# EAGLE schematic Main ACM Hub (EAGLE 9.2.1)
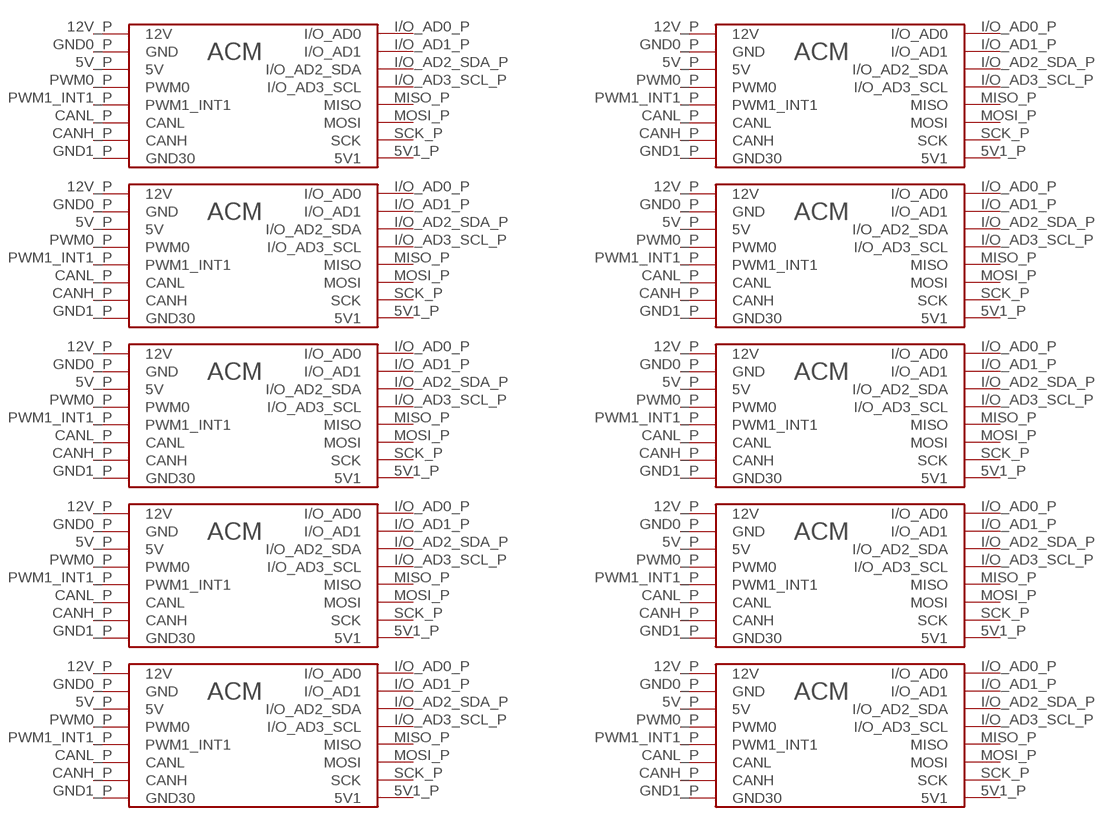
[diagram p0: schematic, sheet 1]

## Parts
U$1  ACM_CASTELLATED  [ACM_CAS_FP]
U$2  ACM_CASTELLATED  [ACM_CAS_FP]
U$3  ACM_CASTELLATED  [ACM_CAS_FP]
U$4  ACM_CASTELLATED  [ACM_CAS_FP]
U$5  ACM_CASTELLATED  [ACM_CAS_FP]
U$6  ACM_CASTELLATED  [ACM_CAS_FP]
U$7  ACM_CASTELLATED  [ACM_CAS_FP]
U$8  ACM_CASTELLATED  [ACM_CAS_FP]
U$9  ACM_CASTELLATED  [ACM_CAS_FP]
U$10  ACM_CASTELLATED  [ACM_CAS_FP]
Unconnected: U$1.5V1_P(5V1) U$1.5V_P(5V) U$1.12V_P(12V) U$1.CANH_P(CANH) U$1.CANL_P(CANL) U$1.GND0_P(GND) U$1.GND1_P(GND30) U$1.I/O_AD0_P(I/O_AD0) U$1.I/O_AD1_P(I/O_AD1) U$1.I/O_AD2_SDA_P(I/O_AD2_SDA) U$1.I/O_AD3_SCL_P(I/O_AD3_SCL) U$1.MISO_P(MISO) U$1.MOSI_P(MOSI) U$1.PWM0_P(PWM0) U$1.PWM1_INT1_P(PWM1_INT1) U$1.SCK_P(SCK) U$2.5V1_P(5V1) U$2.5V_P(5V) U$2.12V_P(12V) U$2.CANH_P(CANH) U$2.CANL_P(CANL) U$2.GND0_P(GND) U$2.GND1_P(GND30) U$2.I/O_AD0_P(I/O_AD0) U$2.I/O_AD1_P(I/O_AD1) U$2.I/O_AD2_SDA_P(I/O_AD2_SDA) U$2.I/O_AD3_SCL_P(I/O_AD3_SCL) U$2.MISO_P(MISO) U$2.MOSI_P(MOSI) U$2.PWM0_P(PWM0) U$2.PWM1_INT1_P(PWM1_INT1) U$2.SCK_P(SCK) U$3.5V1_P(5V1) U$3.5V_P(5V) U$3.12V_P(12V) U$3.CANH_P(CANH) U$3.CANL_P(CANL) U$3.GND0_P(GND) U$3.GND1_P(GND30) U$3.I/O_AD0_P(I/O_AD0) U$3.I/O_AD1_P(I/O_AD1) U$3.I/O_AD2_SDA_P(I/O_AD2_SDA) U$3.I/O_AD3_SCL_P(I/O_AD3_SCL) U$3.MISO_P(MISO) U$3.MOSI_P(MOSI) U$3.PWM0_P(PWM0) U$3.PWM1_INT1_P(PWM1_INT1) U$3.SCK_P(SCK) U$4.5V1_P(5V1) U$4.5V_P(5V) U$4.12V_P(12V) U$4.CANH_P(CANH) U$4.CANL_P(CANL) U$4.GND0_P(GND) U$4.GND1_P(GND30) U$4.I/O_AD0_P(I/O_AD0) U$4.I/O_AD1_P(I/O_AD1) U$4.I/O_AD2_SDA_P(I/O_AD2_SDA) U$4.I/O_AD3_SCL_P(I/O_AD3_SCL) U$4.MISO_P(MISO) U$4.MOSI_P(MOSI) U$4.PWM0_P(PWM0) U$4.PWM1_INT1_P(PWM1_INT1) U$4.SCK_P(SCK) U$5.5V1_P(5V1) U$5.5V_P(5V) U$5.12V_P(12V) U$5.CANH_P(CANH) U$5.CANL_P(CANL) U$5.GND0_P(GND) U$5.GND1_P(GND30) U$5.I/O_AD0_P(I/O_AD0) U$5.I/O_AD1_P(I/O_AD1) U$5.I/O_AD2_SDA_P(I/O_AD2_SDA) U$5.I/O_AD3_SCL_P(I/O_AD3_SCL) U$5.MISO_P(MISO) U$5.MOSI_P(MOSI) U$5.PWM0_P(PWM0) U$5.PWM1_INT1_P(PWM1_INT1) U$5.SCK_P(SCK) U$6.5V1_P(5V1) U$6.5V_P(5V) U$6.12V_P(12V) U$6.CANH_P(CANH) U$6.CANL_P(CANL) U$6.GND0_P(GND) U$6.GND1_P(GND30) U$6.I/O_AD0_P(I/O_AD0) U$6.I/O_AD1_P(I/O_AD1) U$6.I/O_AD2_SDA_P(I/O_AD2_SDA) U$6.I/O_AD3_SCL_P(I/O_AD3_SCL) U$6.MISO_P(MISO) U$6.MOSI_P(MOSI) U$6.PWM0_P(PWM0) U$6.PWM1_INT1_P(PWM1_INT1) U$6.SCK_P(SCK) U$7.5V1_P(5V1) U$7.5V_P(5V) U$7.12V_P(12V) U$7.CANH_P(CANH) U$7.CANL_P(CANL) U$7.GND0_P(GND) U$7.GND1_P(GND30) U$7.I/O_AD0_P(I/O_AD0) U$7.I/O_AD1_P(I/O_AD1) U$7.I/O_AD2_SDA_P(I/O_AD2_SDA) U$7.I/O_AD3_SCL_P(I/O_AD3_SCL) U$7.MISO_P(MISO) U$7.MOSI_P(MOSI) U$7.PWM0_P(PWM0) U$7.PWM1_INT1_P(PWM1_INT1) U$7.SCK_P(SCK) U$8.5V1_P(5V1) U$8.5V_P(5V) U$8.12V_P(12V) U$8.CANH_P(CANH) U$8.CANL_P(CANL) U$8.GND0_P(GND) U$8.GND1_P(GND30) U$8.I/O_AD0_P(I/O_AD0) U$8.I/O_AD1_P(I/O_AD1) U$8.I/O_AD2_SDA_P(I/O_AD2_SDA) U$8.I/O_AD3_SCL_P(I/O_AD3_SCL) U$8.MISO_P(MISO) U$8.MOSI_P(MOSI) U$8.PWM0_P(PWM0) U$8.PWM1_INT1_P(PWM1_INT1) U$8.SCK_P(SCK) U$9.5V1_P(5V1) U$9.5V_P(5V) U$9.12V_P(12V) U$9.CANH_P(CANH) U$9.CANL_P(CANL) U$9.GND0_P(GND) U$9.GND1_P(GND30) U$9.I/O_AD0_P(I/O_AD0) U$9.I/O_AD1_P(I/O_AD1) U$9.I/O_AD2_SDA_P(I/O_AD2_SDA) U$9.I/O_AD3_SCL_P(I/O_AD3_SCL) U$9.MISO_P(MISO) U$9.MOSI_P(MOSI) U$9.PWM0_P(PWM0) U$9.PWM1_INT1_P(PWM1_INT1) U$9.SCK_P(SCK) U$10.5V1_P(5V1) U$10.5V_P(5V) U$10.12V_P(12V) U$10.CANH_P(CANH) U$10.CANL_P(CANL) U$10.GND0_P(GND) U$10.GND1_P(GND30) U$10.I/O_AD0_P(I/O_AD0) U$10.I/O_AD1_P(I/O_AD1) U$10.I/O_AD2_SDA_P(I/O_AD2_SDA) U$10.I/O_AD3_SCL_P(I/O_AD3_SCL) U$10.MISO_P(MISO) U$10.MOSI_P(MOSI) U$10.PWM0_P(PWM0) U$10.PWM1_INT1_P(PWM1_INT1) U$10.SCK_P(SCK)

## Library data of the parts
U$1-U$10 = ACM_Pindown:ACM_CASTELLATED